# EAGLE design I (EAGLE 9.6.2)
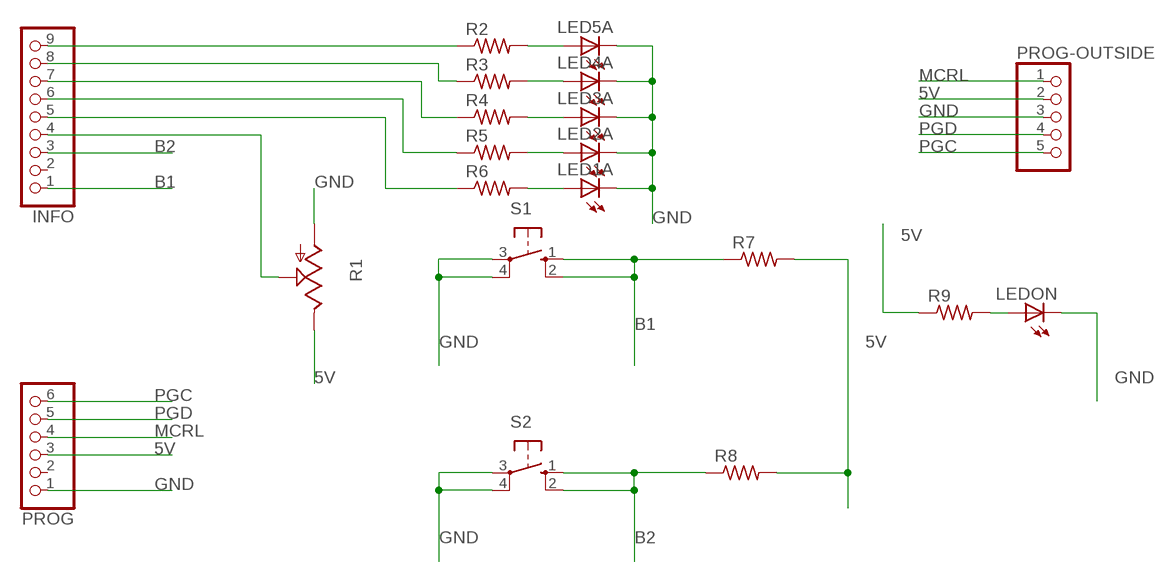
[diagram p0: schematic, sheet 1]

## Parts
INFO  PINHD-1X9/90  [1X09/90]
LED1A  LEDCHIPLED_1206  [CHIPLED_1206]
LED2A  LEDCHIPLED_1206  [CHIPLED_1206]
LED3A  LEDCHIPLED_1206  [CHIPLED_1206]
LED4A  LEDCHIPLED_1206  [CHIPLED_1206]
LED5A  LEDCHIPLED_1206  [CHIPLED_1206]
LEDON  LEDCHIPLED_1206  [CHIPLED_1206]
PROG  PINHD-1X6/90  [1X06/90]
PROG-OUTSIDE  PINHD-1X5/90  [1X05/90]
R1  TRIM_US-CA6V  [CA6V]
R2  R-US_M1206  [M1206]
R3  R-US_M1206  [M1206]
R4  R-US_M1206  [M1206]
R5  R-US_M1206  [M1206]
R6  R-US_M1206  [M1206]
R7  R-US_M1206  [M1206]
R8  R-US_M1206  [M1206]
R9  R-US_M1206  [M1206]
S1  10-XX  [B3F-10XX]
S2  10-XX  [B3F-10XX]

## Nets
5V: PROG-OUTSIDE.2 PROG.3 R1.E R7.2 R8.2 R9.1
B1: INFO.1 R7.1 S1.1(S) S1.2(S1)
B2: INFO.3 R8.1 S2.1(S) S2.2(S1)
GND: LED1A.C LED2A.C LED3A.C LED4A.C LED5A.C LEDON.C PROG-OUTSIDE.3 PROG.1 R1.A S1.3(P) S1.4(P1) S2.3(P) S2.4(P1)
MCRL: PROG-OUTSIDE.1 PROG.4
N$1: LED1A.A R6.2
N$2: LED2A.A R5.2
N$3: LED3A.A R4.2
N$4: LED4A.A R3.2
N$5: LED5A.A R2.2
N$6: INFO.9 R2.1
N$7: INFO.8 R3.1
N$8: INFO.7 R4.1
N$9: INFO.6 R5.1
N$10: INFO.5 R6.1
N$11: INFO.4 R1.S
N$12: LEDON.A R9.2
PGC: PROG-OUTSIDE.5 PROG.6
PGD: PROG-OUTSIDE.4 PROG.5
Unconnected: INFO.2 PROG.2

## Library data of the parts
INFO = pinhead-enhanced-3:PINHD-1X9: PIN HEADER
LED1A LED2A LED3A LED4A LED5A LEDON = adafruit:LED: LED OSRAM: - CHIPLED LG R971, LG N971, LY N971, LG Q971, LY Q971, LO R971, LY R971 LH N974, LH R974 LS Q976, LO Q976, LY Q976 LO Q996 - Hyper CHIPLED LW Q18S LB Q993, LB Q99A, LB R99A - SideLED LS A670, LO A670, LY A670, LG A670, LP A670 LB A673, LV A673, LT A673, LW A673 LH A674 LY A675 LS A676, LA A676, LO A676, LY A676, LW A676 LS A679, LY A679, LG A679 - Hyper Micro SIDELED® LS Y876, LA Y876, LO Y876, LY Y876 LT Y87S - SmartLED LW L88C, LW L88S LB L89C, LB L89S, LG L890 LS L89K, LO L89K, LY L89K LS L896, LA L896, LO L896, LY L896 - TOPLED LS T670, LO T670, LY T670, LG T670, LP T670 LSG T670, LSP T670, LSY T670, LOP T670, LYG T670 LG T671, LOG T671, LSG T671 LB T673, LV T673, LT T673, LW T673 LH T674 LS T676, LA T676, LO T676, LY T676, LB T676, LH T676, LSB T676, LW T676 LB T67C, LV T67C, LT T67C, LS T67K, LO T67K, LY T67K, LW E67C LS E67B, LA E67B, LO E67B, LY E67B, LB E67C, LV E67C, LT E67C LW T67C LS T679, LY T679, LG T679 LS T770, LO T770, LY T770, LG T770, LP T770 LB T773, LV T773, LT T773, LW T773 LH T774 LS E675, LA E675, LY E675, LS T675 LS T776, LA T776, LO T776, LY T776, LB T776 LHGB T686 LT T68C, LB T68C - Hyper Mini TOPLED® LB M676 - Mini TOPLED Santana® LG M470 LS M47K, LO M47K, LY M47K Source: http://www.osram.convergy.de/
PROG = pinhead-enhanced-2:PINHD-1X6: PIN HEADER
PROG-OUTSIDE = pinhead-enhanced-3:PINHD-1X5: PIN HEADER
R1 = pot-enhanced:TRIM_US-: POTENTIOMETER
R2-R9 = rcl:R-US_: RESISTOR, American symbol; SPICEPREFIX: R
S1 S2 = switch-omron:10-XX: OMRON SWITCH; MPN: B3F-1000; OC_FARNELL: 176432; OC_NEWARK: 36M3542

## Board
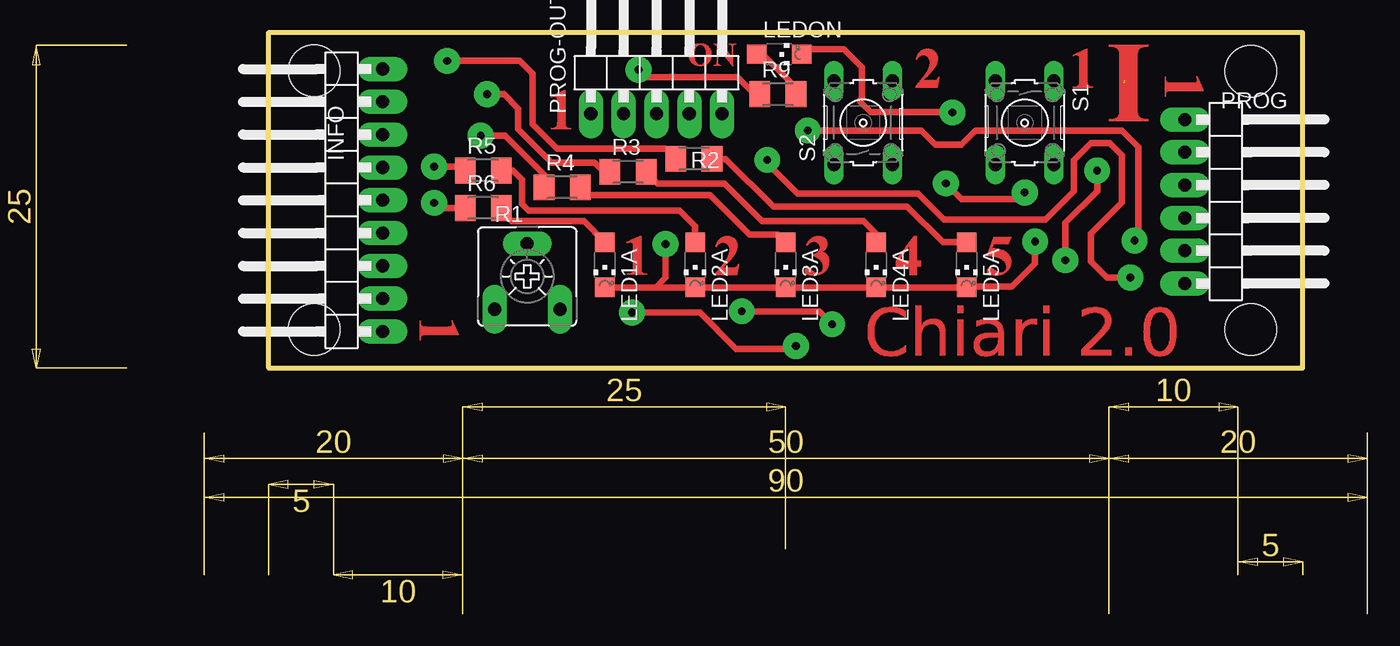
[diagram p1: board, top side]
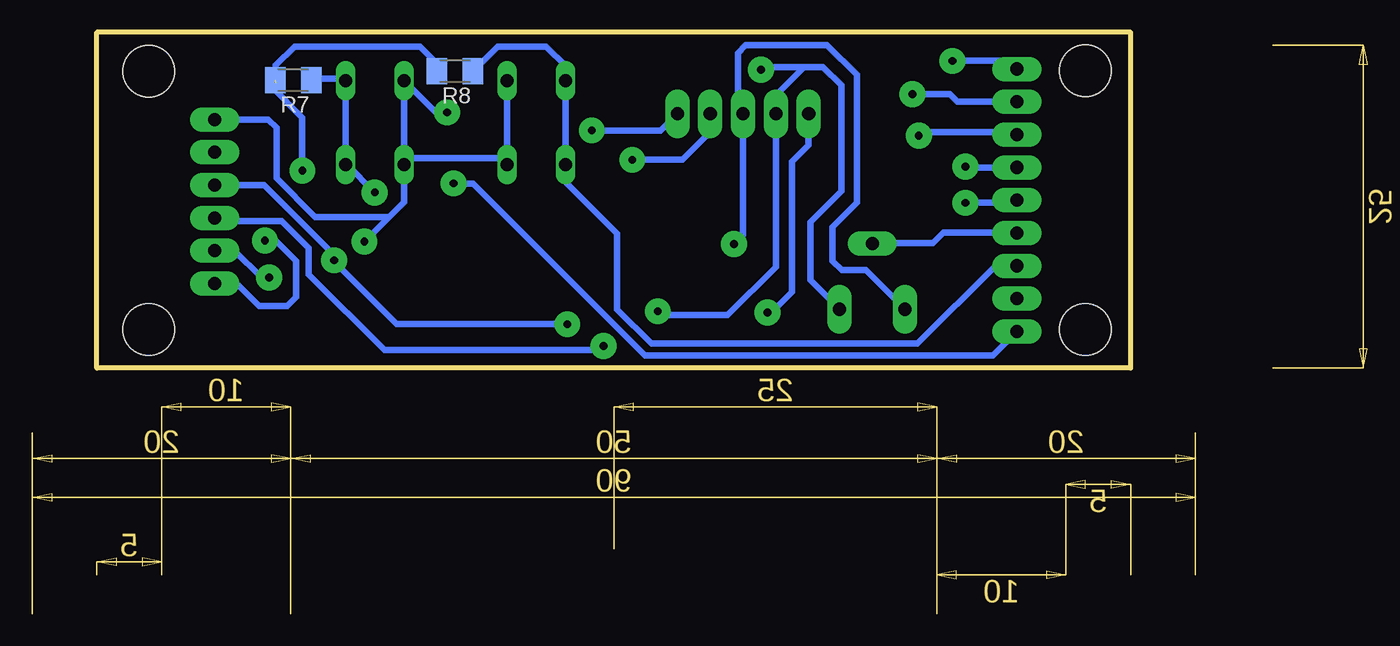
[diagram p2: board, bottom side, seen from below]

Size 80 x 26 mm. Coordinates in mm from the lower left corner, seen from the top.
Outline: 0,0 80,0 80,26 0,26 0,0
Copper layers (1*16): Top 0.035mm / dielectric 1.5mm / Bottom 0.035mm
Design rules "default *": minimum track width 6mil, minimum drill 0.35mm, track to track 6mil, track to pad 6mil, pad to pad 6mil, via to via 6mil, smd to smd 6mil, copper to edge 20mil, drill to drill 6mil, minimum pad ring 10mil, minimum via ring 8mil, stop-mask expansion 4mil, vias tented up to drill 0mil, thermal gap 10mil
Holes 4 mm at 3.51,23.02 76,23 76,3 3.5,3

### Footprints (pad centres in the part's own frame; a part is rotated, then mirrored left to right if it is on the bottom)
1X09/90 = drill 1.016 pad 1.905 long: 1 -10.16,-3.81; 2 -7.62,-3.81; 3 -5.08,-3.81; 4 -2.54,-3.81; 5 0,-3.81; 6 2.54,-3.81; 7 5.08,-3.81; 8 7.62,-3.81; 9 10.16,-3.81
CHIPLED_1206 = smd 1.5 x 1.5: A 0,-1.75; C 0,1.75
1X06/90 = drill 1.016 pad 1.905 long: 1 -6.35,-3.81; 2 -3.81,-3.81; 3 -1.27,-3.81; 4 1.27,-3.81; 5 3.81,-3.81; 6 6.35,-3.81
1X05/90 = drill 1.016 pad 1.905 long: 1 -5.08,-3.81; 2 -2.54,-3.81; 3 0,-3.81; 4 2.54,-3.81; 5 5.08,-3.81
CA6V = drill 1.016 pad 1.905 long: A -2.54,-2.54; E 2.54,-2.54; S 0,2.54
M1206 = smd 1.6 x 2: 1 -1.4,0; 2 1.4,0
B3F-10XX = drill 1.016 long: 1 -3.251,2.261; 2 3.251,2.261; 3 -3.251,-2.261; 4 3.251,-2.261

### Placement (x,y rotation side)
INFO  5,13 90 top
LED1A  26,8 180 top
LED2A  33,8 180 top
LED3A  40,8 180 top
LED4A  47,8 180 top
LED5A  54,8 180 top
LEDON  39.5,24.3 270 top
PROG  74.7,12.9 270 top
PROG-OUTSIDE  30,23.5 0 top
R1  20,7.1 0 top
R2  32.9,16.2 0 top
R3  27.8,15.2 0 top
R4  22.7,14 0 top
R5  16.6,15.3 0 top
R6  16.6,12.4 0 top
R7  64.8,22.3 180 bottom
R8  52.3,23 180 bottom
R9  39.4,21.2 0 top
S1  58.5,19 270 top
S2  46,19 90 top

### Tracks (layer width: path | path; a pad name or v marks a point on that pad's centre or on a via)
5V  (via drill 0.6 pad 2)  (1 unrouted)
  Top 0.5: v64.1,15.3 64.1,13.7 61.65,11.25 v61.65,8.35 | v43.6,3.4 42.6,4.4 v36.6,4.4 | R9.1 37.6,21.2 36.27,22.53 30.51,22.53 30.5,22.52 29.2,22.52 v28.61,23.11
  Bottom 0.5: 66.1,22.4 R7.2 66.4,22.5 66.4,21.7 64.1,19.4 v64.1,15.3 | R1.E 24.8,6.82 24.8,11.3 22.4,13.7 22.4,21.9 23.8,23.3 25.3,23.3 | 27.46,21.24 PROG-OUTSIDE.2 | PROG-OUTSIDE.2 27.46,7.84 31.2,4.1 36.5,4.1 36.7,4.3 v36.6,4.4 | v43.6,3.4 56.81,3.4 61.65,8.24 v61.65,8.35 61.65,8.75 67.07,14.17 PROG.3 | 66.15,22.05 66.15,23.45 64.7,24.9 55,24.9 53.7,23.6 R8.2 | PROG-OUTSIDE.2 27.5,19.73 27.5,21.1 25.3,23.3 | v28.61,23.11 28.42,23.3 25.3,23.3
B1  (via drill 0.6 pad 2)
  Top 0.5: v58.5,13.6 58.5,13.5 58.1,13.1 53.6,13.1 v52.4,14.3
  Bottom 0.5: R7.1 63.3,22.4 60.91,22.4 S1.1 S1.2 60.65,15.75 v58.5,13.6 | INFO.1 10.68,0.97 37.57,0.97 50.9,14.3 v52.4,14.3
B2
  Bottom 0.5: INFO.3 10.48,7.92 16.51,1.89 37.09,1.89 39.74,4.54 39.74,10.41 43.74,14.4 S2.1 S2.2 43.74,23.4 45.24,24.9 49,24.9 R8.1
GND  (via drill 0.6 pad 2)
  Top 0.5: 53.9,6.25 LED4A.C LED3A.C LED2A.C LED1A.C 29.95,6.25 30.7,7 v30.7,9.6 | 53.9,6.25 LED5A.C | v59.3,9.8 59.3,8.1 57.5,6.3 53.95,6.3 53.9,6.25 | LEDON.C 41.65,24.7 44.5,24.7 45.9,23.3 45.9,20.9 45.8,20.8 45.8,20.6 46.6,19.8 v52.9,19.8
  Bottom 0.5: S2.4 S2.3 48.76,16.25 55.74,16.25 S1.4 | S1.4 S1.3 53.79,19.8 v52.9,19.8 | R1.A 20.48,7.58 22.35,7.58 23.07,8.3 23.07,10.93 21.2,12.8 21.2,22.7 23.5,25 29.8,25 30.4,24.4 30.4,20.09 PROG-OUTSIDE.3 30,10.3 v30.7,9.6 | S1.4 56.24,12.86 57.4,11.7 | v59.3,9.8 57.4,11.7 | 70.25,19.25 PROG.1 66.75,19.25 66.1,18.6 66.1,14.7 63.1,11.7 57.4,11.7
MCRL  (via drill 0.6 pad 2)
  Top 0.5: v28.1,4.3 33.36,4.3 36.16,1.5 40.59,1.5 v40.8,1.71
  Bottom 0.5: PROG.4 70.66,11.4 65.7,11.4 63.6,9.3 63.6,7.25 57.75,1.4 40.8,1.4 v40.8,1.71 | PROG-OUTSIDE.1 24.92,17.28 26.2,16 26.2,5.9 27.8,4.3 v28.1,4.3
N$1
  Top 0.5: R6.2 18,12.16 18.8,11.37 24.38,11.37 LED1A.A
N$2
  Top 0.5: LED2A.A 33,11 31.8,12.2 20.1,12.2 19.6,12.7 19.6,14.6 18.9,15.3 R5.2
N$3
  Top 0.5: LED3A.A 39.39,10.36 37.18,10.36 34.14,13.4 24.8,13.4 24.2,14 R4.2
N$4
  Top 0.5: 47,10.4 LED4A.A 47,10.43 46.03,11.4 38.18,11.4 35.28,14.3 30.1,14.3 R3.2
N$5
  Top 0.5: LED5A.A 52.15,9.75 49.4,12.5 39.06,12.5 35.36,16.2 R2.2
N$6  (via drill 0.6 pad 2)
  Top 0.5: v13.8,23.78 19.4,23.78 20.4,22.78 20.4,18.9 22.3,17 30.7,17 R2.1
  Bottom 0.5: INFO.9 9.46,23.81 13.81,23.81 13.8,23.8 v13.8,23.78
N$7  (via drill 0.6 pad 2)
  Top 0.5: v16.9,21.2 18.2,21.2 19.3,20.1 19.3,18.5 21.9,15.9 25.2,15.9 25.9,15.2 R3.1
  Bottom 0.5: v16.9,21.2 14,21.2 13.42,20.62 INFO.8
N$8  (via drill 0.6 pad 2)
  Top 0.5: R4.1 21.3,15 18.3,18 v16.4,18
  Bottom 0.5: INFO.7 9.01,18.28 16.12,18.28 v16.4,18
N$9  (via drill 0.6 pad 2)
  Top 0.5: R5.1 14.9,15.6 v12.8,15.6
  Bottom 0.5: INFO.6 12.74,15.54 v12.8,15.6
N$10  (via drill 0.6 pad 2)
  Top 0.5: R6.1 13.2,12.4 v12.8,12.8
  Bottom 0.5: INFO.5 8.81,12.8 v12.8,12.8
N$11
  Bottom 0.5: INFO.4 8.84,10.49 14.5,10.49 15.29,9.7 19.94,9.7 R1.S
N$12
  Top 0.5: LEDON.A 38.2,24.3 40.8,21.7 R9.2
PGC  (via drill 0.6 pad 2)
  Top 0.5: v67,9.87 67.3,10.18 67.3,17.13 66.03,18.4 54.7,18.4 53.6,17.3 51.6,17.3 50.5,18.4 v41.7,18.4
  Bottom 0.5: PROG-OUTSIDE.5 36.37,18.4 v41.7,18.4 | v67,9.87 66.17,9.87 64.6,8.3 64.6,5.5 65.27,4.83 67.46,4.83 69.19,6.55 PROG.6
PGD  (via drill 0.6 pad 2)
  Top 0.5: v38.58,16.13 38.58,15.83 40.91,13.5 50.24,13.5 52.24,11.5 60.1,11.5 62.3,13.7 62.3,16.1 63.6,17.4 65.1,17.4 66,16.5 66,12.8 63.6,10.4 63.6,8.25 64.84,7.01 v66.67,7.01
  Bottom 0.5: PROG-OUTSIDE.4 32.54,18.26 34.67,16.13 v38.58,16.13 | 71.89,9.11 70.91,9.11 | 70.91,9.11 PROG.5 | 70.91,9.11 69.37,9.11 67.27,7.01 v66.67,7.01
(copper drawn outside any net)
  shapes: Top area x4977

### Text on the board
200bmp: C:/Users/Ariel/GitHub/Sumo-Robot-Programs-Database/boards/mejoras/I/ON.bmp